# EasyEDA schematic PWM_CONTROLLER.json
TITLE: Sheet_1; REV: 1.0; Date: 2025-03-03; Sheet: 1/1; Company: Your Company
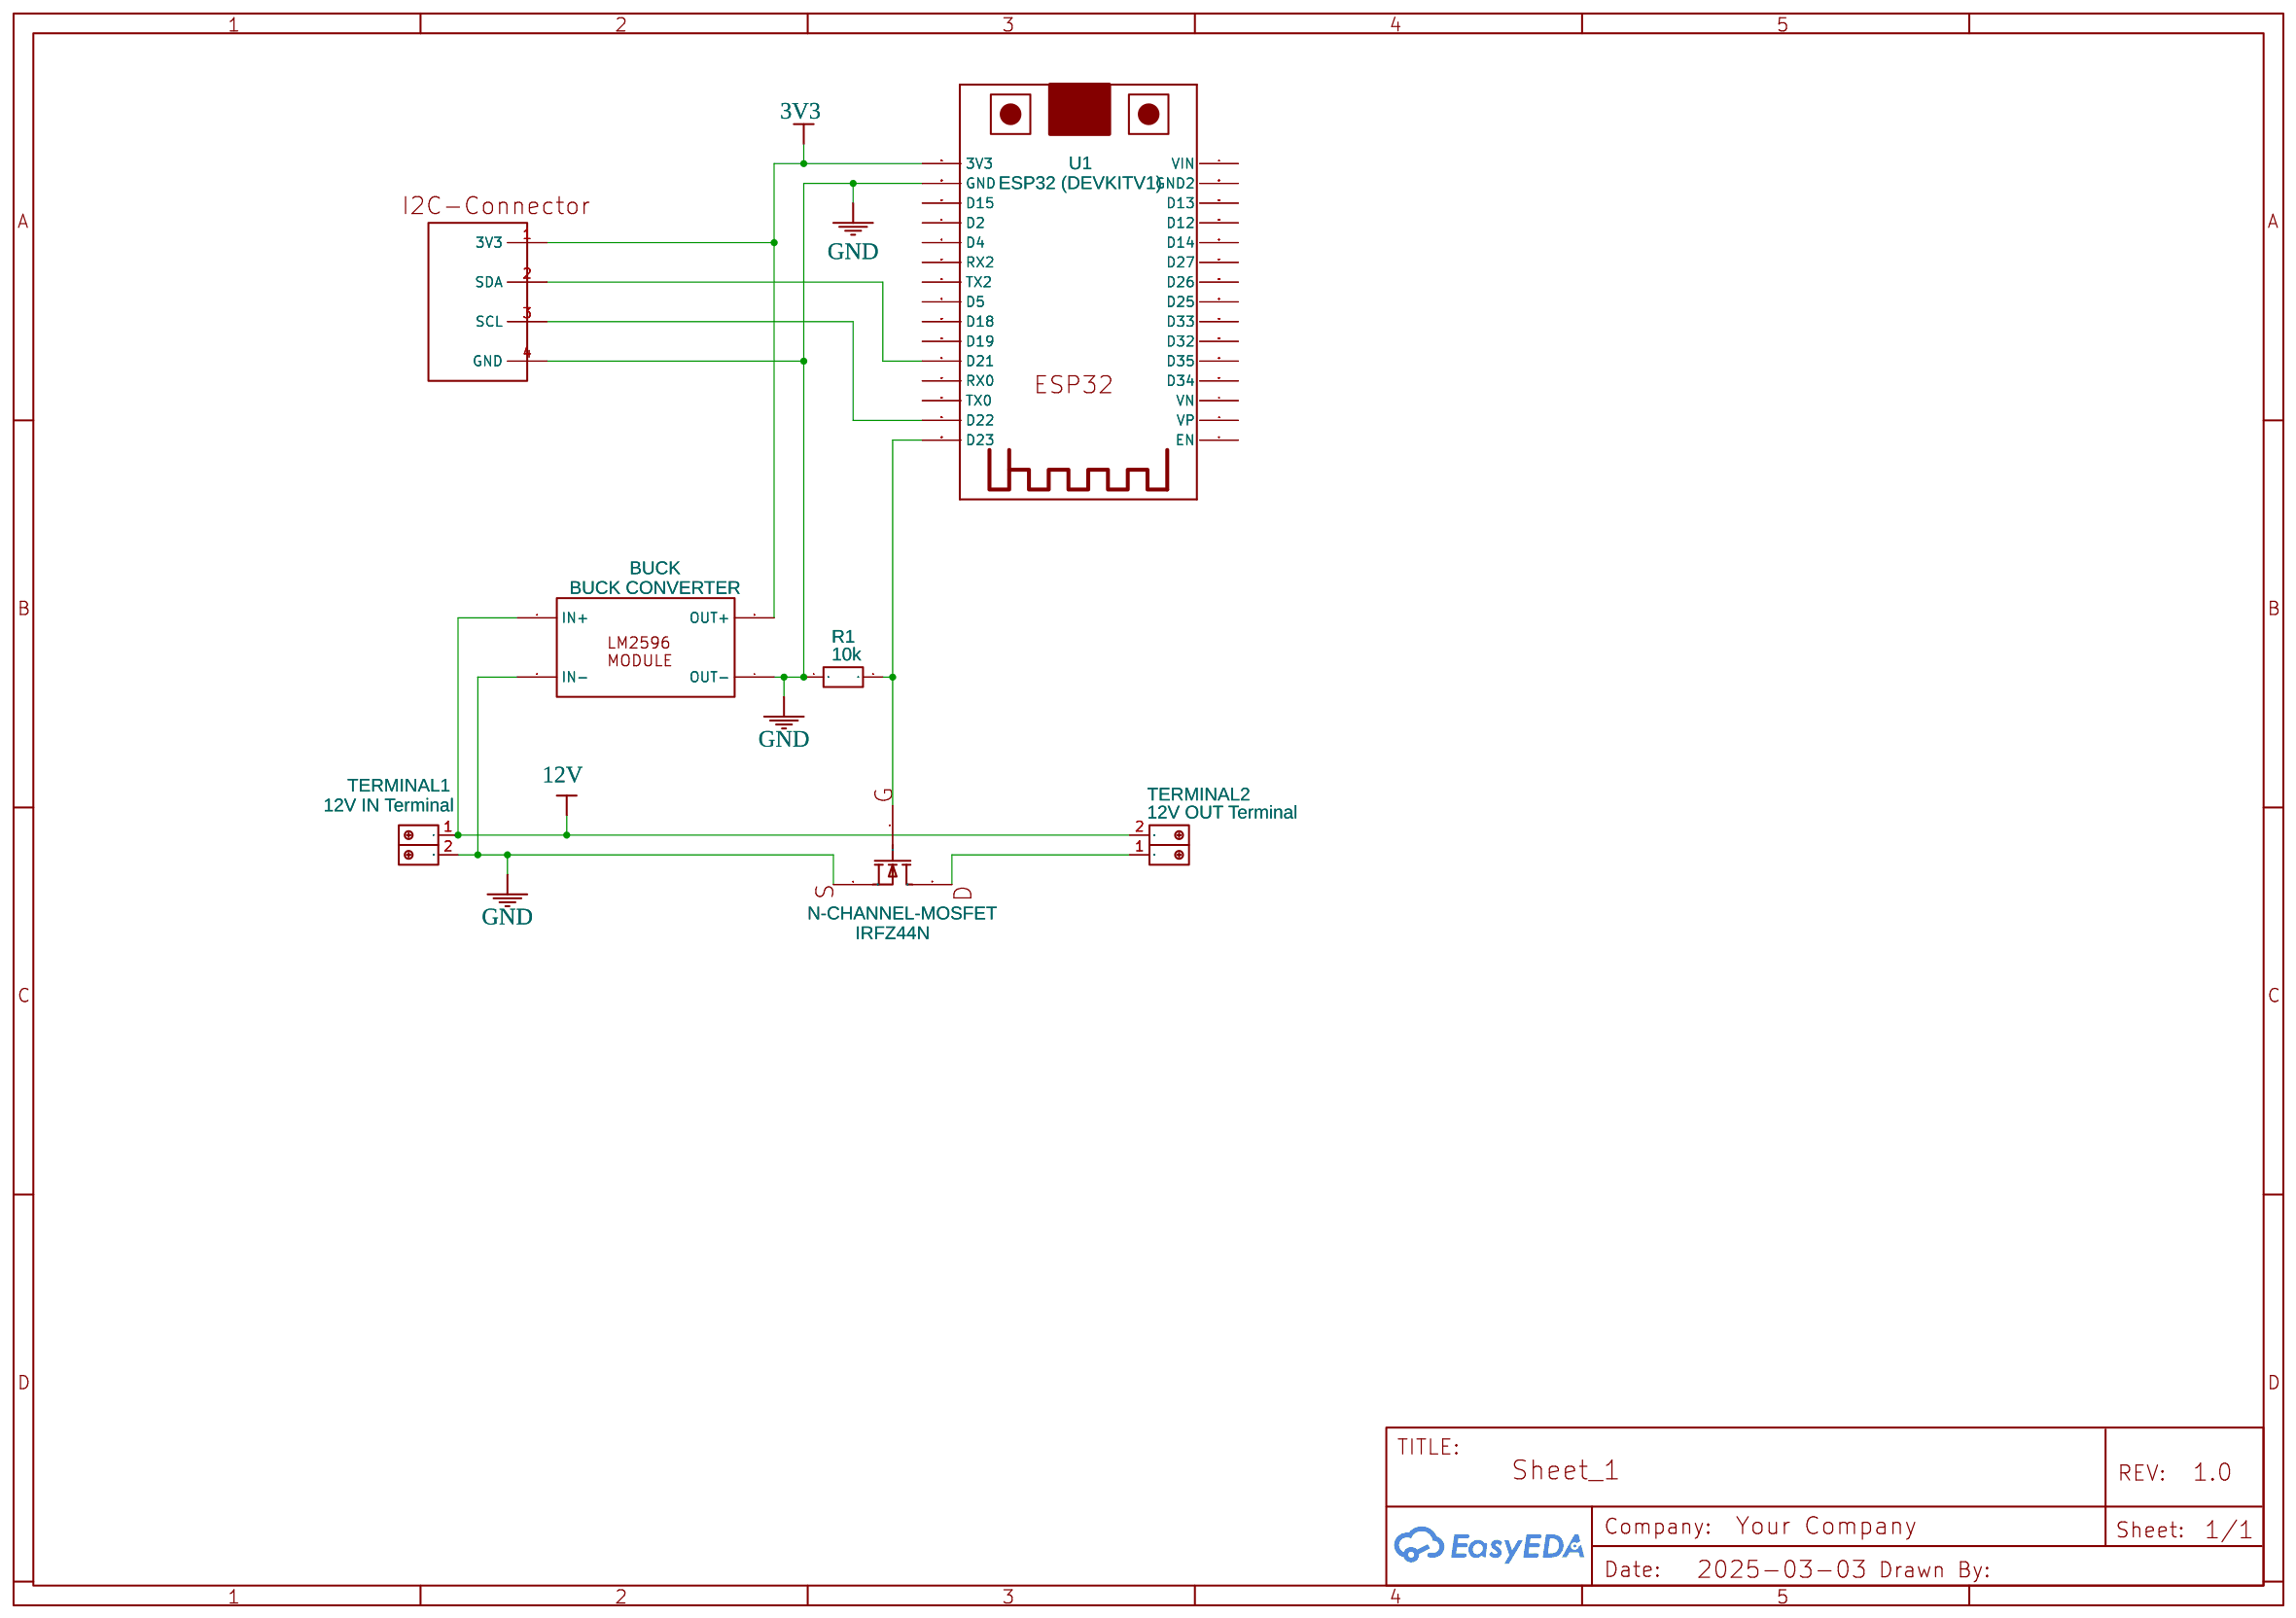
[diagram p0: schematic sheet]

## Parts
BUCK  BUCK CONVERTER  [LM2596S-MODULE]
I2C-CONNECTOR  I2C KEYAD (4 PIN)  [I2C KEYAD I2C (4 PIN)]
N-CHANNEL-MOSFET  IRFZ44N  [IRFZ44N]
R1  10k  [R0603]
TERMINAL1  12V IN Terminal  [1X03_SCREWTERMINAL5.08MM]
TERMINAL2  12V OUT Terminal  [1X03_SCREWTERMINAL5.08MM]
U1  ESP32 (DEVKITV1)  [ESP32-DEVKITV1_ESP32-DEVKITV1]

## Library data of the parts
BUCK = LM2596 MODULE - BUCK CONVERTER: Manufacturer Part: LM2596-MODULE; Contributor: myloveisvyvy
I2C-CONNECTOR = I2C KEYAD (4 PIN): Contributor: aschewski
N-CHANNEL-MOSFET = MOSFET IRFZ44N: HEXFET Power MOSFET; Contributor: johnkennethabaquita2003
R1 = R_0603_EU: Contributor: LCEDA_Lib
TERMINAL1 TERMINAL2 = Screw terminal 2p: Contributor: J.cruz
U1 = ESP32-DEVKIT-V1-30PIN: Contributor: satish.lakhan29

## Nets
3V3: BUCK.3(OUT+) I2C-CONNECTOR.1(3V3) U1.3V3
12V: BUCK.1(IN+) TERMINAL1.1 TERMINAL2.2
GND: BUCK.2(IN-) BUCK.4(OUT-) I2C-CONNECTOR.4(GND) N-CHANNEL-MOSFET.3(S) R1.1 TERMINAL1.2 U1.GND
Net-(I2C-CONNECTOR-2): I2C-CONNECTOR.2(SDA) U1.D21
Net-(I2C-CONNECTOR-3): I2C-CONNECTOR.3(SCL) U1.D22
Net-(N-CHANNEL-MOSFET-1): N-CHANNEL-MOSFET.1(G) R1.2 U1.D23
Net-(N-CHANNEL-MOSFET-2): N-CHANNEL-MOSFET.2(D) TERMINAL2.1

Not connected (* = marked no-connect by the designer): U1 D2 D4 D5 D12 D13 D14 D15 D18 D19 D25 D26 D27 D32 D33 D34 D35 EN GND2 RX0 RX2 TX0 TX2 VIN VN VP
